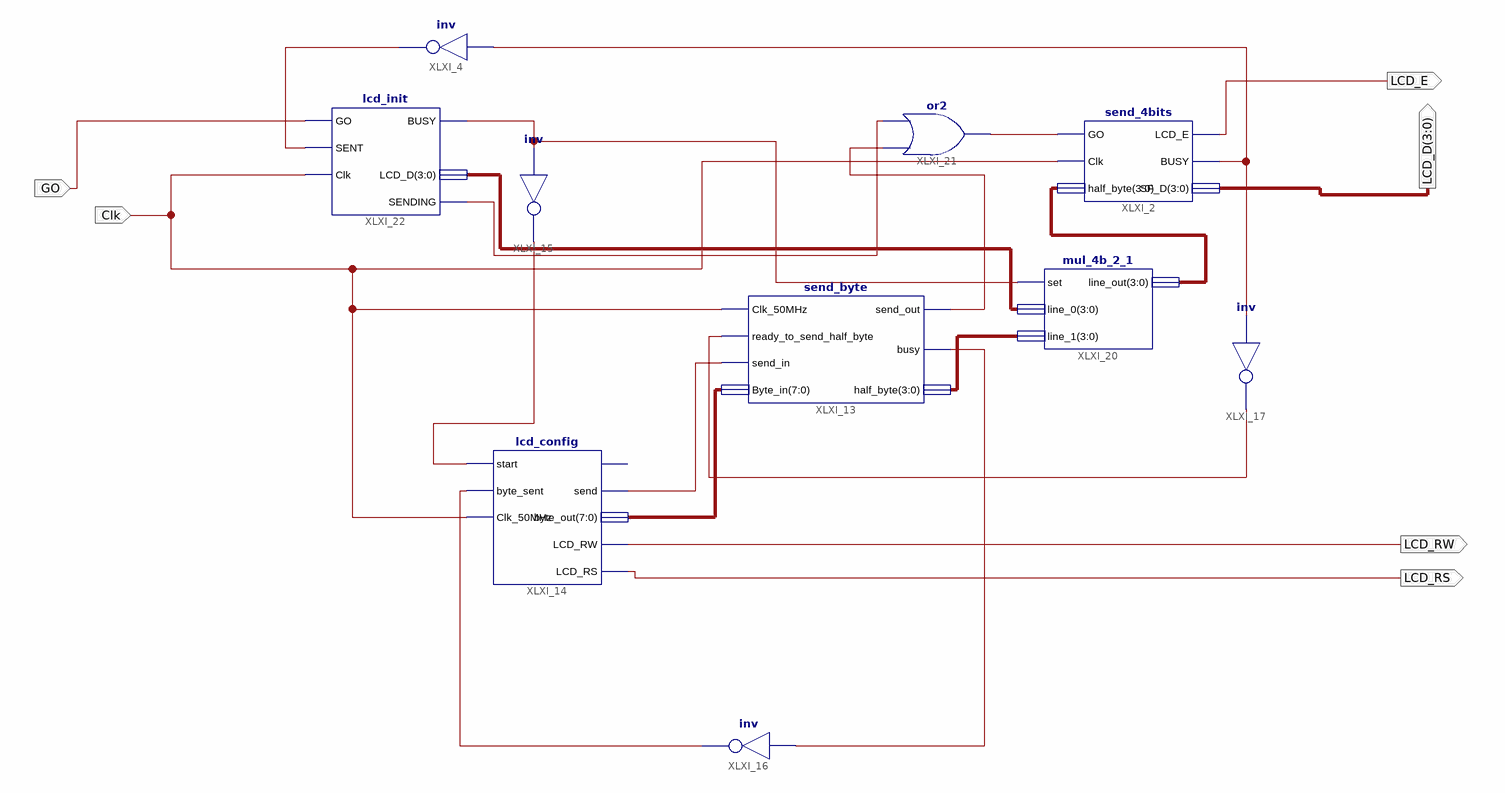
[diagram p0: schematic sheet 1]
// Xilinx ISE schematic lcd_module.sch (spartan3e) as structural Verilog: 10 symbols, 6 ports
module lcd_module (
  input  Clk,
  input  GO,
  output LCD_E,
  output [3:0] LCD_D,
  output LCD_RS,
  output LCD_RW
);

  wire XLXN_40, XLXN_41, XLXN_42, XLXN_45, XLXN_46, XLXN_75, XLXN_76, XLXN_80, XLXN_81, XLXN_83, XLXN_90;
  wire [3:0] XLXN_49, XLXN_50, XLXN_79;
  wire [7:0] XLXN_38;

  send_4bits XLXI_2 (.GO(XLXN_76), .Clk(Clk), .half_byte(XLXN_50), .LCD_E(LCD_E), .BUSY(XLXN_45), .SF_D(LCD_D));
  not XLXI_4 (XLXN_83, XLXN_45);
  lcd_config XLXI_14 (
    .start(XLXN_90), .byte_sent(XLXN_42), .Clk_50MHz(Clk), .send(XLXN_40), .LCD_RW(LCD_RW), .LCD_RS(LCD_RS),
    .byte_out(XLXN_38));  // open: busy
  not XLXI_15 (XLXN_90, XLXN_81);
  not XLXI_16 (XLXN_42, XLXN_41);
  not XLXI_17 (XLXN_46, XLXN_45);
  mul_4b_2_1 XLXI_20 (.set(XLXN_81), .line_0(XLXN_79), .line_1(XLXN_49), .line_out(XLXN_50));
  or XLXI_21 (XLXN_76, XLXN_75, XLXN_80);
  lcd_init XLXI_22 (.GO(GO), .SENT(XLXN_83), .Clk(Clk), .BUSY(XLXN_81), .SENDING(XLXN_80), .LCD_D(XLXN_79));
  send_byte XLXI_13 (
    .Clk_50MHz(Clk), .ready_to_send_half_byte(XLXN_46), .send_in(XLXN_40), .Byte_in(XLXN_38),
    .send_out(XLXN_75), .busy(XLXN_41), .half_byte(XLXN_49));
endmodule
